# Altium schematic sheet vending_machine_V1.0.SchDoc
size A4; SheetNumber: 1; SheetTotal: 1
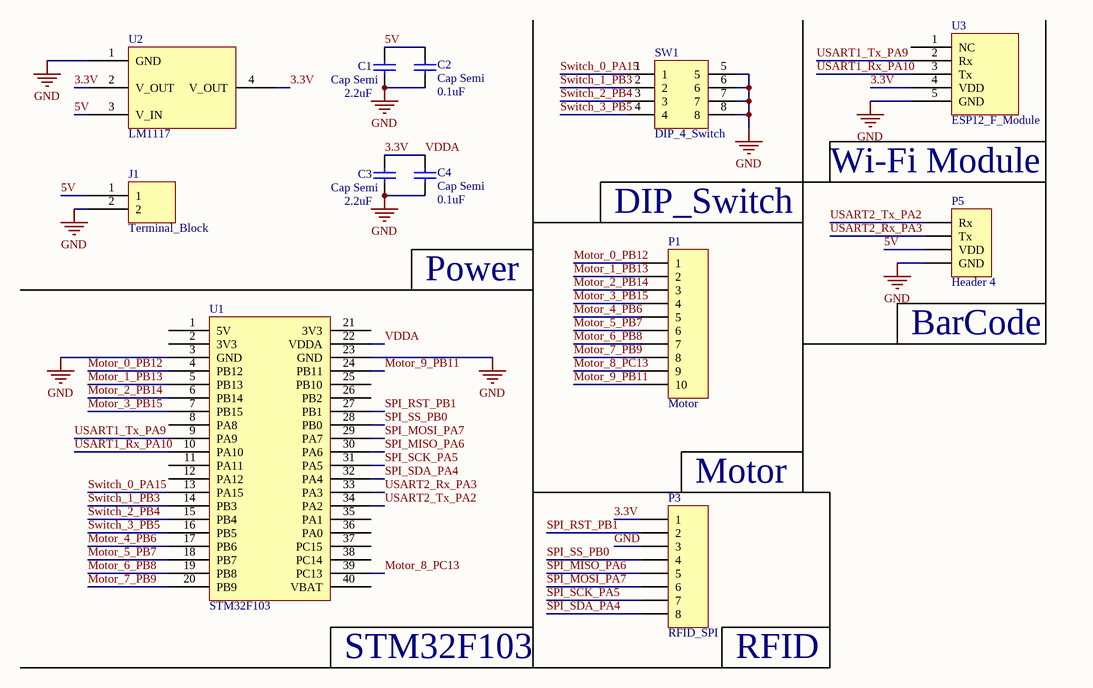
[diagram p0: vending_machine_V1.0.SchDoc]

## Parts
C1  Cap Semi  value 2.2uF  [1608[0603]]
C2  Cap Semi  value 0.1uF  [1608[0603]]
C3  Cap Semi  value 2.2uF  [1608[0603]]
C4  Cap Semi  value 0.1uF  [1608[0603]]
J1  Terminal_Block  [terminal block]
P1  Motor  [HDR1X10]
P3  RFID_SPI  [HDR1X8]
P5  Header 4  [HDR1X4]
SW1  DIP_4_Switch  [Switch_4]
U1  STM32F103  [STM32F103]
U2  LM1117  [LM1117 - duplicate]
U3  ESP12_F_Module  [ESP12_F_Holtek]

## Nets
GND: C1.1 C2.1 C3.1 C4.1 J1.2 P3.3 P5.4(GND) SW1.5 SW1.6 SW1.7 SW1.8 U1.3(GND) U1.23(GND) U2.1(GND) U3.5(GND)
3.3V: C3.2 C4.2 P3.1 U1.22(VDDA) U2.2(V_OUT) U2.4(V_OUT) U3.4(VDD)  [also labelled VDDA]
5V: C1.2 C2.2 J1.1 P5.3(VDD) U2.3(V_IN)
Motor_0_PB12: P1.1 U1.4(PB12)
Motor_1_PB13: P1.2 U1.5(PB13)
Motor_2_PB14: P1.3 U1.6(PB14)
Motor_3_PB15: P1.4 U1.7(PB15)
Motor_4_PB6: P1.5 U1.17(PB6)
Motor_5_PB7: P1.6 U1.18(PB7)
Motor_6_PB8: P1.7 U1.19(PB8)
Motor_7_PB9: P1.8 U1.20(PB9)
Motor_8_PC13: P1.9 U1.39(PC13)
Motor_9_PB11: P1.10 U1.24(PB11)
SPI_MISO_PA6: P3.5 U1.30(PA6)
SPI_MOSI_PA7: P3.6 U1.29(PA7)
SPI_RST_PB1: P3.2 U1.27(PB1)
SPI_SCK_PA5: P3.7 U1.31(PA5)
SPI_SDA_PA4: P3.8 U1.32(PA4)
SPI_SS_PB0: P3.4 U1.28(PB0)
Switch_0_PA15: SW1.1 U1.13(PA15)
Switch_1_PB3: SW1.2 U1.14(PB3)
Switch_2_PB4: SW1.3 U1.15(PB4)
Switch_3_PB5: SW1.4 U1.16(PB5)
USART1_Rx_PA10: U1.10(PA10) U3.3(Tx)
USART1_Tx_PA9: U1.9(PA9) U3.2(Rx)
USART2_Rx_PA3: P5.2(Tx) U1.33(PA3)
USART2_Tx_PA2: P5.1(Rx) U1.34(PA2)

Not connected (* = marked no-connect by the designer): U1 1(5V) 2(3V3) 8(PA8) 11(PA11) 12(PA12) 21(3V3) 25(PB10) 26(PB2) 35(PA1) 36(PA0) 37(PC15) 38(PC14) 40(VBAT); U3 1(NC)

## Notes on the sheet
- (near P1) DIP_Switch
- Wi-Fi Module
- Power
- (near P5) BarCode
- (near P3) Motor
- (near U1) STM32F103
- RFID

## Library data of the parts
C1-C4 = Cap Semi: Capacitor (Semiconductor SIM Model); Published: 8-Jun-2000; LatestRevisionDate: 29-May-2009; LatestRevisionNote: IPC-7351 Footprint Added.; PackageReference: C1206; Publisher: Altium Limited; PackageDescription: Chip Capacitor
J1 = Terminal Block
P1 = Header 10: Header, 10-Pin; LatestRevisionDate: 17-Jul-2002; LatestRevisionNote: Re-released for DXP Platform.; Publisher: Altium Limited
P3 = Header 8: Header, 8-Pin; LatestRevisionDate: 17-Jul-2002; LatestRevisionNote: Re-released for DXP Platform.; Publisher: Altium Limited
P5 = Header 4: Header, 4-Pin; LatestRevisionDate: 17-Jul-2002; LatestRevisionNote: Re-released for DXP Platform.; Publisher: Altium Limited
SW1 = Switch_4
U3 = ESP12_F_Holtek